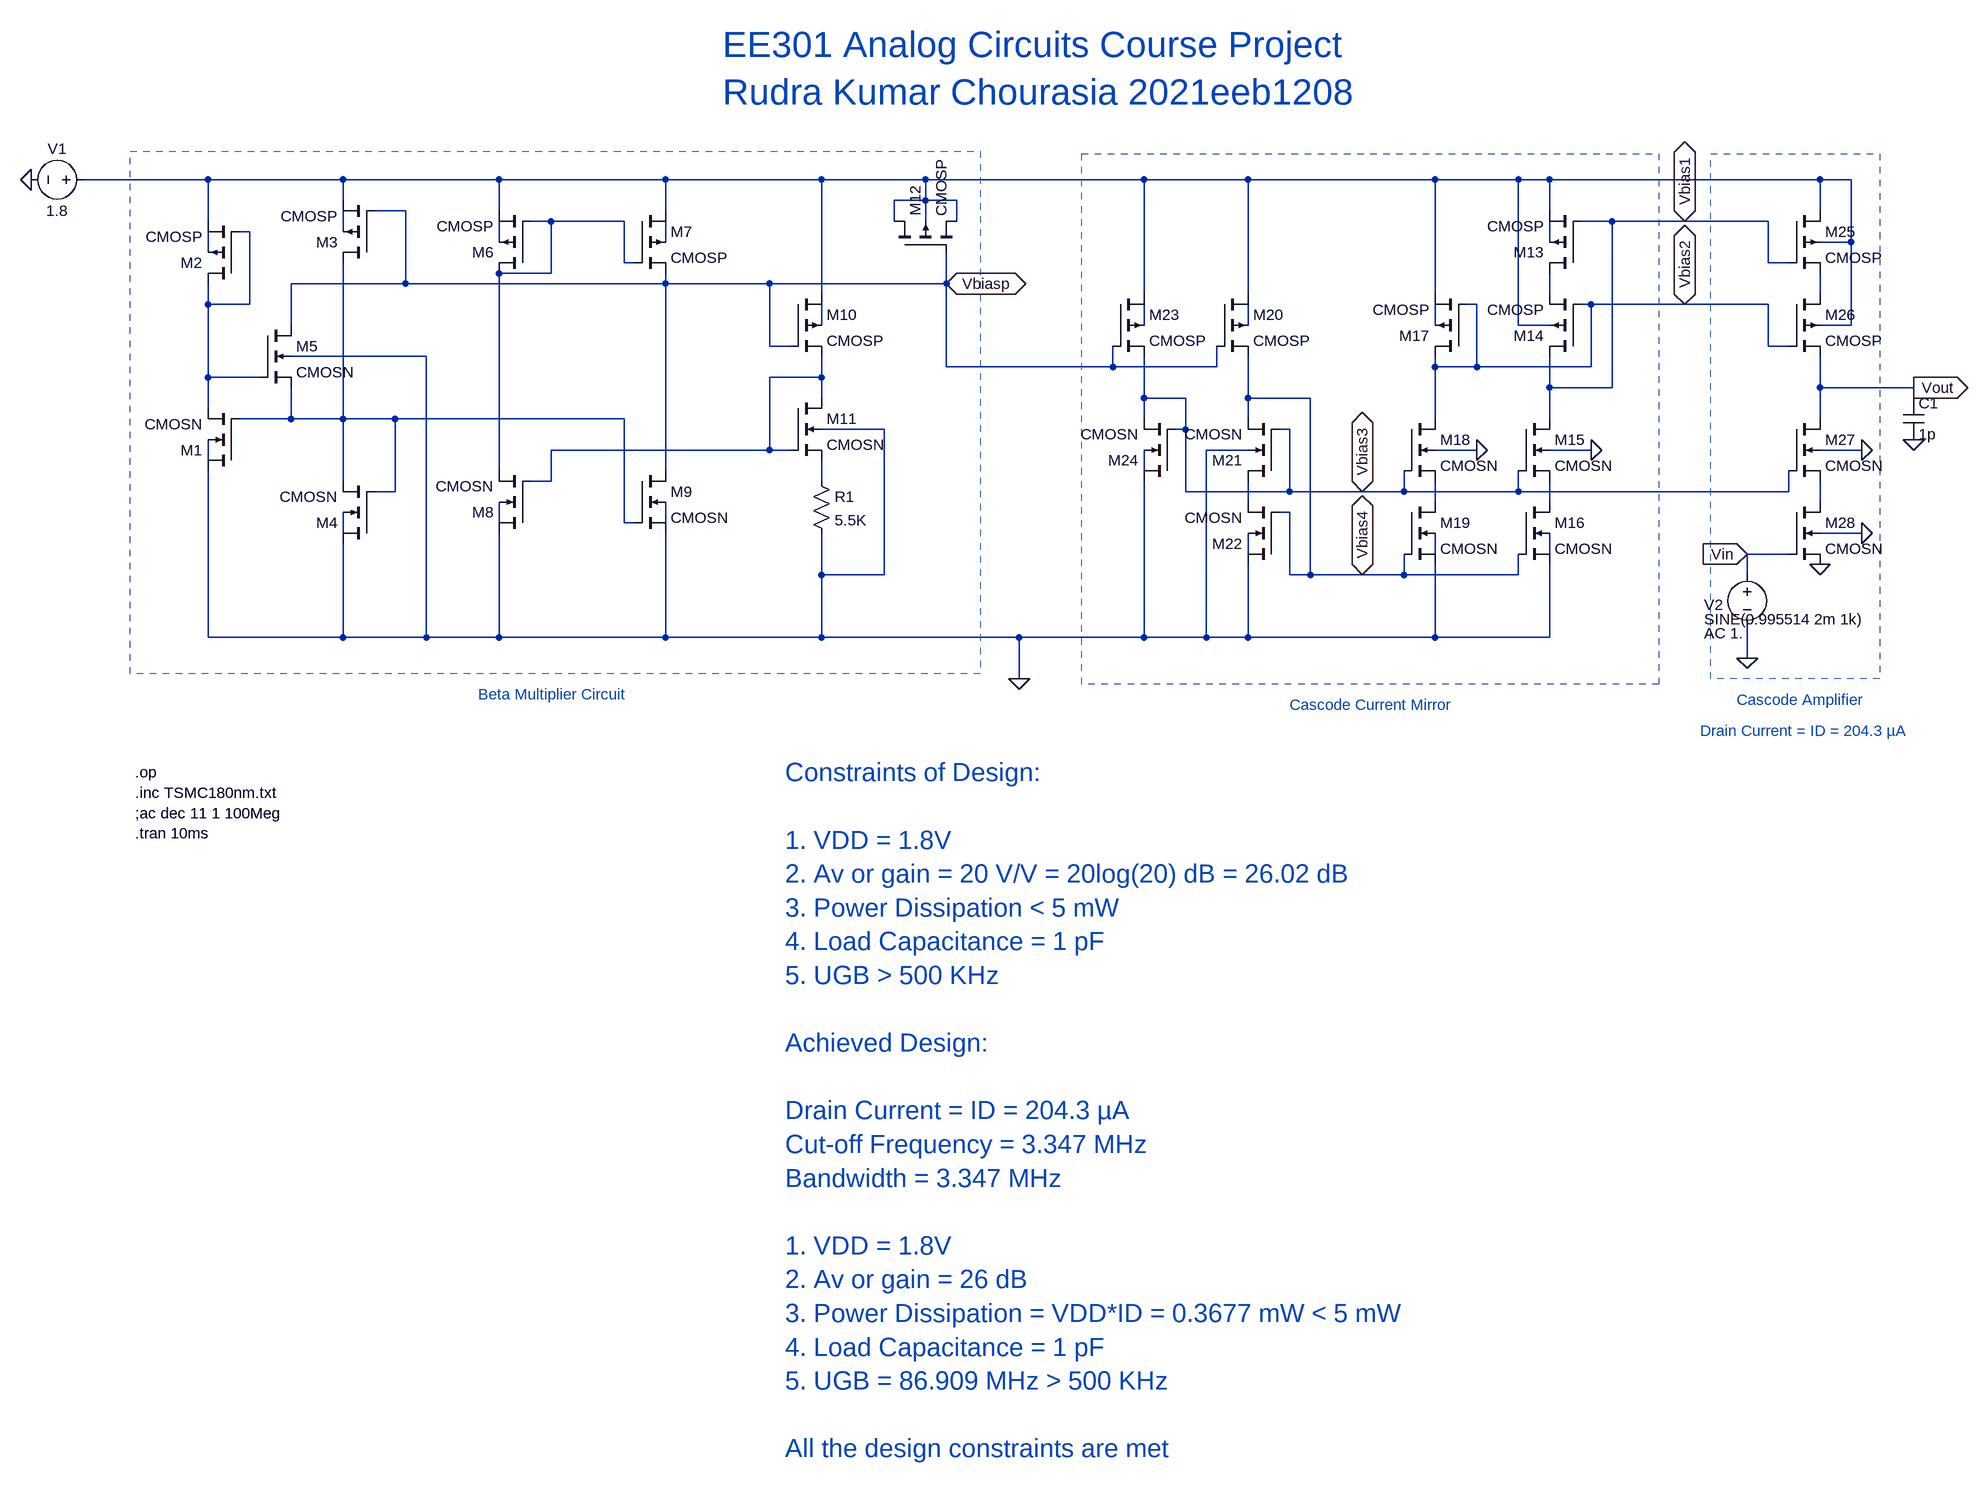
[diagram p0: schematic 180nm_2021eeb1225.asc]
180nm_2021eeb1225.asc, the LTspice schematic file:
Version 4
SHEET 1 1396 992
WIRE -1328 -720 -1520 -720
WIRE -1120 -720 -1328 -720
WIRE -880 -720 -1120 -720
WIRE -624 -720 -880 -720
WIRE -384 -720 -624 -720
WIRE -224 -720 -384 -720
WIRE 112 -720 -224 -720
WIRE 272 -720 112 -720
WIRE 560 -720 272 -720
WIRE 688 -720 560 -720
WIRE 736 -720 688 -720
WIRE 1152 -720 736 -720
WIRE 1200 -720 1152 -720
WIRE -1120 -688 -1120 -720
WIRE -224 -688 -224 -720
WIRE -224 -688 -272 -688
WIRE -176 -688 -224 -688
WIRE -1024 -672 -1072 -672
WIRE -880 -672 -880 -720
WIRE -624 -672 -624 -720
WIRE 736 -672 736 -720
WIRE 1152 -672 1152 -720
WIRE -1328 -656 -1328 -720
WIRE -800 -656 -832 -656
WIRE -688 -656 -800 -656
WIRE -272 -656 -272 -688
WIRE -224 -656 -224 -688
WIRE -176 -656 -176 -688
WIRE 832 -656 784 -656
WIRE 944 -656 832 -656
WIRE 1072 -656 944 -656
WIRE -1264 -640 -1280 -640
WIRE -1120 -640 -1120 -672
WIRE -880 -624 -880 -656
WIRE -624 -624 -624 -656
WIRE 736 -624 736 -656
WIRE 1200 -624 1200 -720
WIRE 1200 -624 1152 -624
WIRE -1328 -608 -1328 -640
WIRE -688 -592 -688 -656
WIRE -672 -592 -688 -592
WIRE 1072 -592 1072 -656
WIRE 1104 -592 1072 -592
WIRE -800 -576 -800 -656
WIRE -800 -576 -880 -576
WIRE -1024 -560 -1024 -672
WIRE -1024 -560 -1200 -560
WIRE -624 -560 -624 -576
WIRE -624 -560 -1024 -560
WIRE -464 -560 -624 -560
WIRE -192 -560 -192 -608
WIRE -192 -560 -464 -560
WIRE -384 -544 -384 -720
WIRE 112 -544 112 -720
WIRE 272 -544 272 -720
WIRE 560 -544 560 -720
WIRE 736 -544 736 -576
WIRE 1152 -544 1152 -576
WIRE -1328 -528 -1328 -560
WIRE -1264 -528 -1264 -640
WIRE -1264 -528 -1328 -528
WIRE 624 -528 608 -528
WIRE 800 -528 784 -528
WIRE 944 -528 800 -528
WIRE 1072 -528 944 -528
WIRE -1200 -496 -1200 -560
WIRE -384 -496 -384 -528
WIRE 112 -496 112 -528
WIRE 272 -496 272 -528
WIRE 560 -496 560 -528
WIRE 688 -496 688 -720
WIRE 736 -496 688 -496
WIRE 1200 -496 1200 -624
WIRE 1200 -496 1152 -496
WIRE -464 -464 -464 -560
WIRE -432 -464 -464 -464
WIRE 1072 -464 1072 -528
WIRE 1104 -464 1072 -464
WIRE -992 -448 -1200 -448
WIRE -192 -432 -192 -560
WIRE 64 -432 64 -464
WIRE 64 -432 -192 -432
WIRE 224 -432 224 -464
WIRE 224 -432 64 -432
WIRE 560 -432 560 -448
WIRE 624 -432 624 -528
WIRE 624 -432 560 -432
WIRE 800 -432 800 -528
WIRE 800 -432 624 -432
WIRE -1328 -416 -1328 -528
WIRE -1248 -416 -1328 -416
WIRE -384 -416 -384 -448
WIRE -384 -416 -464 -416
WIRE 736 -400 736 -448
WIRE 832 -400 832 -656
WIRE 832 -400 736 -400
WIRE 1152 -400 1152 -448
WIRE 1296 -400 1152 -400
WIRE -384 -384 -384 -416
WIRE 112 -384 112 -448
WIRE 176 -384 112 -384
WIRE 272 -384 272 -448
WIRE 368 -384 272 -384
WIRE 1296 -384 1296 -400
WIRE -1328 -368 -1328 -416
WIRE -1200 -352 -1200 -400
WIRE -1200 -352 -1280 -352
WIRE -1120 -352 -1120 -592
WIRE -1120 -352 -1200 -352
WIRE -1040 -352 -1120 -352
WIRE -688 -352 -1040 -352
WIRE 112 -352 112 -384
WIRE 272 -352 272 -384
WIRE 560 -352 560 -432
WIRE 736 -352 736 -400
WIRE 1152 -352 1152 -400
WIRE -288 -336 -384 -336
WIRE 176 -336 176 -384
WIRE 176 -336 160 -336
WIRE 336 -336 320 -336
WIRE -464 -304 -464 -416
WIRE -464 -304 -800 -304
WIRE -432 -304 -464 -304
WIRE 272 -304 208 -304
WIRE 624 -304 560 -304
WIRE 800 -304 736 -304
WIRE 1216 -304 1152 -304
WIRE -1328 -288 -1328 -320
WIRE -880 -272 -880 -576
WIRE -624 -272 -624 -560
WIRE 112 -272 112 -304
WIRE -1120 -256 -1120 -352
WIRE -800 -256 -800 -304
WIRE -800 -256 -832 -256
WIRE -384 -256 -384 -288
WIRE -1040 -240 -1040 -352
WIRE -1040 -240 -1072 -240
WIRE 176 -240 176 -336
WIRE 336 -240 336 -336
WIRE 336 -240 176 -240
WIRE 448 -240 336 -240
WIRE 512 -240 512 -272
WIRE 512 -240 448 -240
WIRE 688 -240 688 -272
WIRE 688 -240 512 -240
WIRE 1104 -240 1104 -272
WIRE 1104 -240 688 -240
WIRE 272 -224 272 -256
WIRE 560 -224 560 -256
WIRE 736 -224 736 -256
WIRE 1152 -224 1152 -256
WIRE 336 -208 320 -208
WIRE -880 -192 -880 -224
WIRE -688 -192 -688 -352
WIRE -672 -192 -688 -192
WIRE -624 -192 -624 -224
WIRE -1120 -176 -1120 -208
WIRE 1216 -176 1152 -176
WIRE 272 -144 272 -176
WIRE 560 -144 560 -176
WIRE 736 -144 736 -176
WIRE 1104 -144 1040 -144
WIRE -384 -112 -384 -176
WIRE -288 -112 -288 -336
WIRE -288 -112 -384 -112
WIRE 336 -112 336 -208
WIRE 368 -112 368 -384
WIRE 368 -112 336 -112
WIRE 448 -112 368 -112
WIRE 512 -112 512 -144
WIRE 512 -112 448 -112
WIRE 688 -112 688 -144
WIRE 688 -112 512 -112
WIRE 1040 -112 1040 -144
WIRE -1328 -16 -1328 -272
WIRE -1120 -16 -1120 -160
WIRE -1120 -16 -1328 -16
WIRE -992 -16 -992 -448
WIRE -992 -16 -1120 -16
WIRE -880 -16 -880 -176
WIRE -880 -16 -992 -16
WIRE -624 -16 -624 -176
WIRE -624 -16 -880 -16
WIRE -384 -16 -384 -112
WIRE -384 -16 -624 -16
WIRE -80 -16 -384 -16
WIRE 112 -16 112 -256
WIRE 112 -16 -80 -16
WIRE 208 -16 208 -304
WIRE 208 -16 112 -16
WIRE 272 -16 272 -128
WIRE 272 -16 208 -16
WIRE 560 -16 560 -128
WIRE 560 -16 272 -16
WIRE 736 -16 736 -128
WIRE 736 -16 560 -16
WIRE 1040 16 1040 -32
WIRE -80 48 -80 -16
FLAG -1600 -720 0
FLAG -192 -560 Vbiasp
IOPIN -192 -560 BiDir
FLAG -80 48 0
FLAG 448 -240 Vbias3
IOPIN 448 -240 BiDir
FLAG 448 -112 Vbias4
IOPIN 448 -112 BiDir
FLAG 944 -656 Vbias1
IOPIN 944 -656 BiDir
FLAG 944 -528 Vbias2
IOPIN 944 -528 BiDir
FLAG 1296 -320 0
FLAG 1296 -400 Vout
IOPIN 1296 -400 Out
FLAG 624 -304 0
FLAG 800 -304 0
FLAG 1216 -304 0
FLAG 1152 -128 0
FLAG 1040 16 0
FLAG 1216 -176 0
FLAG 1040 -144 Vin
IOPIN 1040 -144 In
DATAFLAG 1072 -720 "$"
DATAFLAG 1152 -400 "$"
DATAFLAG 592 -112 "$"
DATAFLAG 1056 -656 "$"
DATAFLAG 1040 -528 "$"
DATAFLAG 1040 -240 "$"
SYMBOL nmos4 -1280 -272 R180
SYMATTR InstName M1
SYMATTR Value CMOSN
SYMATTR Value2 l=0.36u w=1.8u
SYMBOL pmos4 -1280 -560 R180
SYMATTR InstName M2
SYMATTR Value CMOSP
SYMATTR Value2 l=3.6u w=1.8u
SYMBOL voltage -1504 -720 R90
WINDOW 0 -32 56 VBottom 2
WINDOW 3 32 56 VTop 2
SYMATTR InstName V1
SYMATTR Value 1.8
SYMBOL pmos4 -1072 -592 R180
SYMATTR InstName M3
SYMATTR Value CMOSP
SYMATTR Value2 l=0.36u w=4.32u
SYMBOL nmos4 -1072 -160 R180
SYMATTR InstName M4
SYMATTR Value CMOSN
SYMATTR Value2 l=0.36u w=1.8u
SYMBOL nmos4 -1248 -496 R0
SYMATTR InstName M5
SYMATTR Value CMOSN
SYMATTR Value2 l=0.36u w=0.72u
SYMBOL pmos4 -832 -576 R180
SYMATTR InstName M6
SYMATTR Value CMOSP
SYMATTR Value2 l=0.36u w=4.32u
SYMBOL pmos4 -672 -672 R0
SYMATTR InstName M7
SYMATTR Value CMOSP
SYMATTR Value2 l=0.36u w=4.32u
SYMBOL nmos4 -832 -176 R180
SYMATTR InstName M8
SYMATTR Value CMOSN
SYMATTR Value2 l=0.36u w=1.8u
SYMBOL nmos4 -672 -272 R0
SYMATTR InstName M9
SYMATTR Value CMOSN
SYMATTR Value2 l=0.36u w=1.8u
SYMBOL pmos4 -432 -544 R0
SYMATTR InstName M10
SYMATTR Value CMOSP
SYMATTR Value2 l=0.36u w=4.32u
SYMBOL nmos4 -432 -384 R0
SYMATTR InstName M11
SYMATTR Value CMOSN
SYMATTR Value2 l=0.36u w=5.4u
SYMBOL Res -400 -272 R0
SYMATTR InstName R1
SYMATTR Value 5.5K
SYMBOL pmos4 -272 -608 R270
SYMATTR InstName M12
SYMATTR Value CMOSP
SYMATTR Value2 l=9u w=9u
SYMBOL pmos4 784 -576 R180
SYMATTR InstName M13
SYMATTR Value CMOSP
SYMATTR Value2 l=0.36u w=3.809001u
SYMBOL pmos4 784 -448 R180
SYMATTR InstName M14
SYMATTR Value CMOSP
SYMATTR Value2 l=0.36u w=36u
SYMBOL nmos4 688 -352 R0
SYMATTR InstName M15
SYMATTR Value CMOSN
SYMATTR Value2 l=3.6u w=1.8u
SYMBOL nmos4 688 -224 R0
SYMATTR InstName M16
SYMATTR Value CMOSN
SYMATTR Value2 l=0.36u w=18u
SYMBOL pmos4 608 -448 R180
SYMATTR InstName M17
SYMATTR Value CMOSP
SYMATTR Value2 l=0.368u w=0.9241u
SYMBOL nmos4 512 -352 R0
SYMATTR InstName M18
SYMATTR Value CMOSN
SYMATTR Value2 l=3.6u w=2.4u
SYMBOL nmos4 512 -224 R0
SYMATTR InstName M19
SYMATTR Value CMOSN
SYMATTR Value2 l=0.36u w=18u
SYMBOL pmos4 224 -544 R0
SYMATTR InstName M20
SYMATTR Value CMOSP
SYMATTR Value2 l=0.36u w=36u
SYMBOL nmos4 320 -256 R180
SYMATTR InstName M21
SYMATTR Value CMOSN
SYMATTR Value2 l=0.36u w=1.08u
SYMBOL nmos4 320 -128 R180
SYMATTR InstName M22
SYMATTR Value CMOSN
SYMATTR Value2 l=0.36u w=9u
SYMBOL pmos4 64 -544 R0
SYMATTR InstName M23
SYMATTR Value CMOSP
SYMATTR Value2 l=0.36u w=64.37u
SYMBOL nmos4 160 -256 R180
SYMATTR InstName M24
SYMATTR Value CMOSN
SYMATTR Value2 l=0.36u w=0.05u
SYMBOL pmos4 1104 -672 R0
SYMATTR InstName M25
SYMATTR Value CMOSP
SYMATTR Value2 l=0.36u w=19.44u
SYMBOL pmos4 1104 -544 R0
SYMATTR InstName M26
SYMATTR Value CMOSP
SYMATTR Value2 l=0.36u w=28.62u
SYMBOL nmos4 1104 -352 R0
SYMATTR InstName M27
SYMATTR Value CMOSN
SYMATTR Value2 l=0.36u w=2.88u
SYMBOL nmos4 1104 -224 R0
SYMATTR InstName M28
SYMATTR Value CMOSN
SYMATTR Value2 l=0.36u w=2.34u
SYMBOL Voltage 1040 -128 R0
WINDOW 3 -66 84 Left 2
WINDOW 0 -66 62 Left 2
WINDOW 39 0 0 Left 0
WINDOW 123 -66 106 Left 2
SYMATTR Value SINE(0.995514 2m 1k)
SYMATTR InstName V2
SYMATTR Value2 AC 1.
SYMBOL Cap 1280 -384 R0
SYMATTR InstName C1
SYMATTR Value 1p
TEXT -912 72 Left 2 ;Beta Multiplier Circuit
TEXT 336 88 Left 2 ;Cascode Current Mirror
TEXT 1024 80 Left 2 ;Cascode Amplifier
TEXT -536 -928 Left 5 ;EE301 Analog Circuits Course Project\nRudra Kumar Chourasia 2021eeb1208
TEXT -1440 192 Left 2 !.op \n.inc TSMC180nm.txt\n;ac dec 11 1 100Meg\n.tran 10ms
TEXT -440 192 Left 4 ;Constraints of Design:\n \n1. VDD = 1.8V\n2. Av or gain = 20 V/V = 20log(20) dB = 26.02 dB\n3. Power Dissipation < 5 mW\n4. Load Capacitance = 1 pF\n5. UGB > 500 KHz\n \nAchieved Design:\n \nDrain Current = ID = 204.3 µA\nCut-off Frequency = 3.347 MHz\nBandwidth = 3.347 MHz\n \n1. VDD = 1.8V\n2. Av or gain = 26 dB \n3. Power Dissipation = VDD*ID = 0.3677 mW < 5 mW\n4. Load Capacitance = 1 pF\n5. UGB = 86.909 MHz > 500 KHz\n \nAll the design constraints are met
TEXT 968 128 Left 2 ;Drain Current = ID = 204.3 µA
RECTANGLE Normal -1448 -764 -140 40 1
RECTANGLE Normal 16 -760 904 56 1
RECTANGLE Normal 984 -760 1244 48 1

The netlist it stands for:
* 180nm_2021eeb1225.asc
M1 0 N016 N003 N017 CMOSN l=0.36u w=1.8u
M2 N003 N003 N001 N008 CMOSP l=3.6u w=1.8u
V1 N001 0 1.8
M3 N016 Vbiasp N001 N004 CMOSP l=0.36u w=4.32u
M4 0 N016 N016 N026 CMOSN l=0.36u w=1.8u
M5 Vbiasp N003 N016 0 CMOSN l=0.36u w=0.72u
M6 N002 N002 N001 N005 CMOSP l=0.36u w=4.32u
M7 N001 N002 Vbiasp N006 CMOSP l=0.36u w=4.32u
M8 0 N015 N002 N024 CMOSN l=0.36u w=1.8u
M9 Vbiasp N016 0 N025 CMOSN l=0.36u w=1.8u
M10 N001 Vbiasp N015 N011 CMOSP l=0.36u w=4.32u
M11 N015 N015 N019 0 CMOSN l=0.36u w=5.4u
R1 N019 0 5.5K
M12 N001 Vbiasp N001 N001 CMOSP l=9u w=9u
M13 N009 Vbias1 N001 N007 CMOSP l=0.36u w=3.809001u
M14 Vbias1 Vbias2 N009 N001 CMOSP l=0.36u w=36u
M15 Vbias1 Vbias3 N022 0 CMOSN l=3.6u w=1.8u
M16 N022 Vbias4 0 N029 CMOSN l=0.36u w=18u
M17 Vbias2 Vbias2 N001 N014 CMOSP l=0.368u w=0.9241u
M18 Vbias2 Vbias3 N021 0 CMOSN l=3.6u w=2.4u
M19 N021 Vbias4 0 N028 CMOSN l=0.36u w=18u
M20 N001 Vbiasp Vbias4 N013 CMOSP l=0.36u w=36u
M21 N020 Vbias3 Vbias4 0 CMOSN l=0.36u w=1.08u
M22 0 Vbias4 N020 N027 CMOSN l=0.36u w=9u
M23 N001 Vbiasp Vbias3 N012 CMOSP l=0.36u w=64.37u
M24 0 Vbias3 Vbias3 N018 CMOSN l=0.36u w=0.05u
M25 N001 Vbias1 N010 N001 CMOSP l=0.36u w=19.44u
M26 N010 Vbias2 Vout N001 CMOSP l=0.36u w=28.62u
M27 Vout Vbias3 N023 0 CMOSN l=0.36u w=2.88u
M28 N023 Vin 0 0 CMOSN l=0.36u w=2.34u
V2 Vin 0 SINE(0.995514 2m 1k) AC 1.
C1 Vout 0 1p
.model NMOS NMOS
.model PMOS PMOS
.lib standard.mos
* Beta Multiplier Circuit
* Cascode Current Mirror
* Cascode Amplifier
* EE301 Analog Circuits Course Project
* Rudra Kumar Chourasia 2021eeb1208
.op
.inc TSMC180nm.txt
;ac dec 11 1 100Meg
.tran 10ms
* Constraints of Design:
* 1. VDD = 1.8V
* 2. Av or gain = 20 V/V = 20log(20) dB = 26.02 dB
* 3. Power Dissipation < 5 mW
* 4. Load Capacitance = 1 pF
* 5. UGB > 500 KHz
* Achieved Design:
* Drain Current = ID = 204.3 µA
* Cut-off Frequency = 3.347 MHz
* Bandwidth = 3.347 MHz
* 1. VDD = 1.8V
* 2. Av or gain = 26 dB
* 3. Power Dissipation = VDD*ID = 0.3677 mW < 5 mW
* 4. Load Capacitance = 1 pF
* 5. UGB = 86.909 MHz > 500 KHz
* All the design constraints are met
* Drain Current = ID = 204.3 µA
.backanno
.end